# Altium schematic sheet Nueron.SchDoc
size A4; SheetNumber: 1; SheetTotal: 1; SPICEModelCacheLTBKIITM: <root> / <DocumentId>LTBKIITM</DocumentId> / </root>
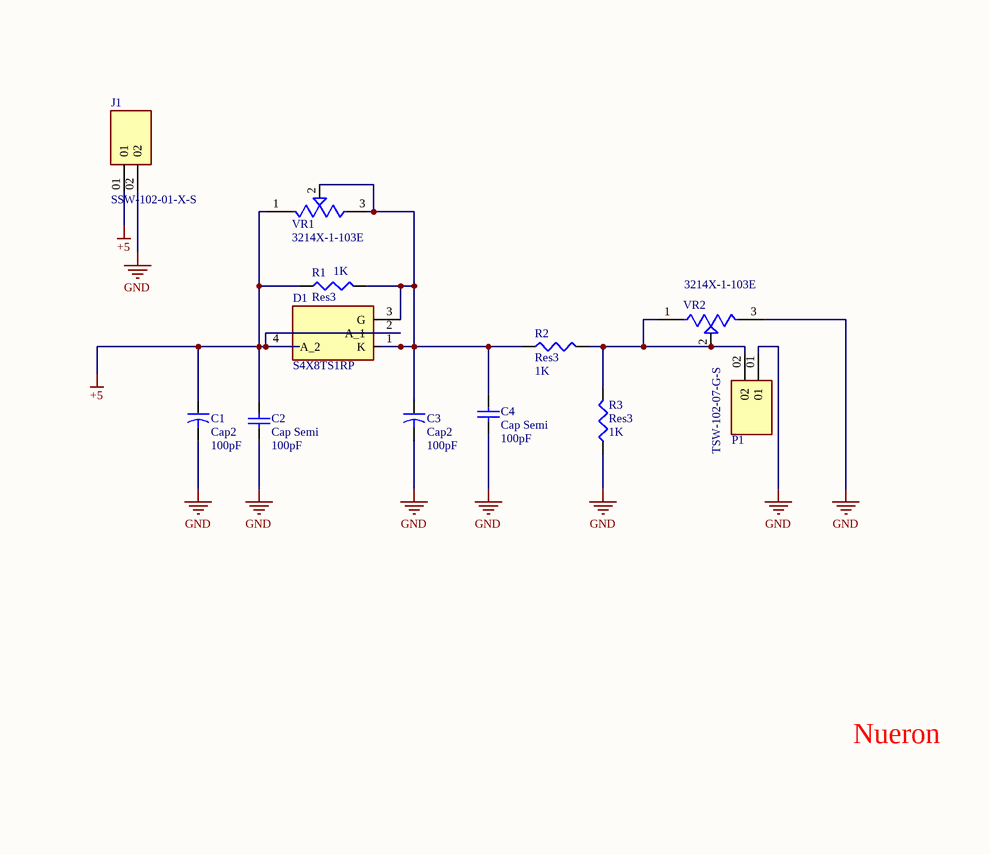
[diagram p0: Nueron.SchDoc, left]
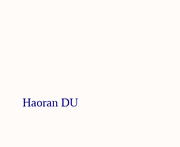
[diagram p1: Nueron.SchDoc, right]

## Parts
C1  Cap2  value 100pF  [CAPR5-4X5]
C2  Cap Semi  value 100pF  [C1206]
C3  Cap2  value 100pF  [CAPR5-4X5]
C4  Cap Semi  value 100pF  [C1206]
D1  S4X8TS1RP  [S4X8TS1RP]
J1  SSW-102-01-X-S  [TSW-102-XX-YY-S]
P1  TSW-102-07-G-S  [SAMTEC_TSW-102-07-G-S]
R1  Res3  value 1K  [J1-0603]
R2  Res3  value 1K  [J1-0603]
R3  Res3  value 1K  [J1-0603]
VR1  3214X-1-103E  [3214X1203E]
VR2  3214X-1-103E  [3214X1203E]

## Nets
+5: C1.1 C2.2 D1.2(A_1) D1.4(A_2) J1.01 R1.1 VR1.1(CCW)
GND: C1.2 C2.1 C3.2 C4.1 J1.02 P1.01 R3.1 VR2.3(CW)
NetC3_1: C3.1 C4.2 D1.1(K) D1.3(G) R1.2 R2.1 VR1.2(WIPER) VR1.3(CW)
NetP1_02: P1.02 R2.2 R3.2 VR2.1(CCW) VR2.2(WIPER)

## Notes on the sheet
- Nueron
- Haoran DU

## Library data of the parts
C1 C3 = Cap2: Capacitor; Published: 23-Sep-2002; PackageReference: CAPR5-4X5; Publisher: Altium Limited; PackageDescription: Capacitor; 2 Leads
C2 C4 = Cap Semi: Capacitor (Semiconductor SIM Model); Published: 8-Jun-2000; LatestRevisionDate: 29-May-2009; LatestRevisionNote: IPC-7351 Footprint Added.; PackageReference: C1206; Publisher: Altium Limited; PackageDescription: Chip Capacitor
D1 = S4X8TS1RP: Thyristor; Manufacturer_Name: LITTELFUSE; Datasheet Link: https://www.littelfuse.com/media?resourcetype=datasheets&itemid=33d0d5e7-46fd-406d-80ae-f94899e78783&filename=littelfuse-thyristor-sxx8xsx-datasheet; Height: 1.93mm; Manufacturer_Part_Number: S4X8TS1RP; Mouser Part Number: 576-S4X8TS1RP; Mouser Price/Stock: https://www.mouser.com/Search/Refine.aspx?Keyword=576-S4X8TS1RP
J1 = SSW-102-01-X-S: 2 Position Receptacle Connector Through Hole; MP: SSW-102-01-G-S; MF: Samtec; Purchase-URL: https://pricing.snapeda.com/search/part/SSW-102-01-G-S/?ref=eda; Price: None; SnapEDA_Link: https://www.snapeda.com/parts/SSW-102-01-G-S/Samtec/view-part/4872079/?ref=snap; Check_prices: https://www.snapeda.com/parts/SSW-102-01-G-S/Samtec/view-part/4872079/?ref=eda; Package: None; Availability: Good; Value: *
P1 = TSW-102-07-G-S: <a href="https://pricing.snapeda.com/parts/TSW-102-07-G-S/Samtec/view-part?ref=eda">Check availability</a>; MF: Samtec Inc.; Package: None; Price: None; Value: *; MP: TSW-102-07-G-S; Availability: Unavailable
R1-R3 = Res3: Resistor; Published: 8-Jun-2000; LatestRevisionDate: 29-May-2009; LatestRevisionNote: IPC-7351 Footprint Added.; PackageReference: J1-0603; Publisher: Altium Limited; PackageDescription: Chip Resistor
VR1 VR2 = 3214X-1-103E: 10 kOhms 0.25W, 1/4W Gull Wing Surface Mount Trimmer Potentiometer Cermet 5 Turn Top Adjustment; MF: Bourns; Package: 6432 Bourns; Availability: Good; Value: *; MP: 3214X-1-103E; SnapEDA_Link: https://www.snapeda.com/parts/3214X-1-103E/Bourns/view-part/287161/?ref=snap; Price: None; Purchase-URL: https://pricing.snapeda.com/search/part/3214X-1-103E/?ref=eda; Check_prices: https://www.snapeda.com/parts/3214X-1-103E/Bourns/view-part/287161/?ref=eda